# Altium project stm32f103_64_plc_PCB.PrjPcb
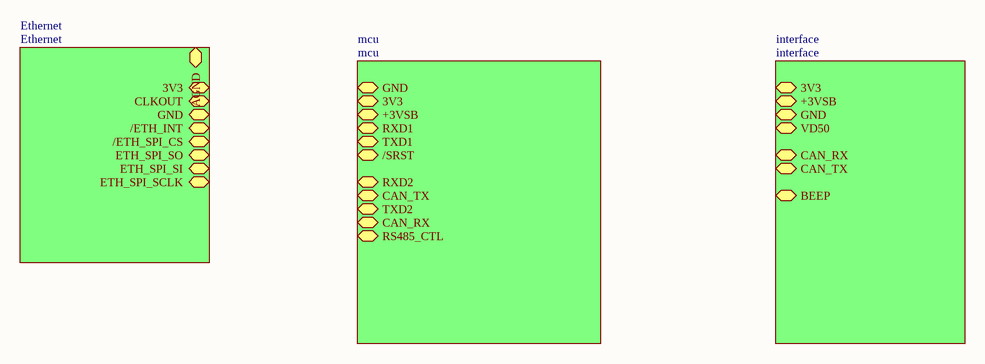
[diagram p0: root.SchDoc]
4 sheets, 109 parts. Net scope: hierarchical (ports join the sheet entries above them; power ports are global).
Board file: plc.PcbDoc
Sheets:
  root.SchDoc
    mcu = mcu.SchDoc
    interface = interface.SchDoc
    Ethernet = Ethernet.SchDoc

## Sheet root.SchDoc
size A4

### Sub-sheets
Ethernet = Ethernet: 3V3, CLKOUT, GND, /ETH_INT, /ETH_SPI_CS, ETH_SPI_SO, ETH_SPI_SI, ETH_SPI_SCLK, AGND
interface = interface: 3V3, +3VSB, GND, VD50, CAN_RX, BEEP, CAN_TX
mcu = mcu: GND, 3V3, +3VSB, RXD1, TXD1, /SRST, RXD2, CAN_TX, TXD2, CAN_RX, RS485_CTL

### Nets
3V3: sheet mcu/3V3, sheet interface/3V3
GND: sheet mcu/GND, sheet interface/GND, sheet Ethernet/GND

## Sheet mcu.SchDoc
size A4
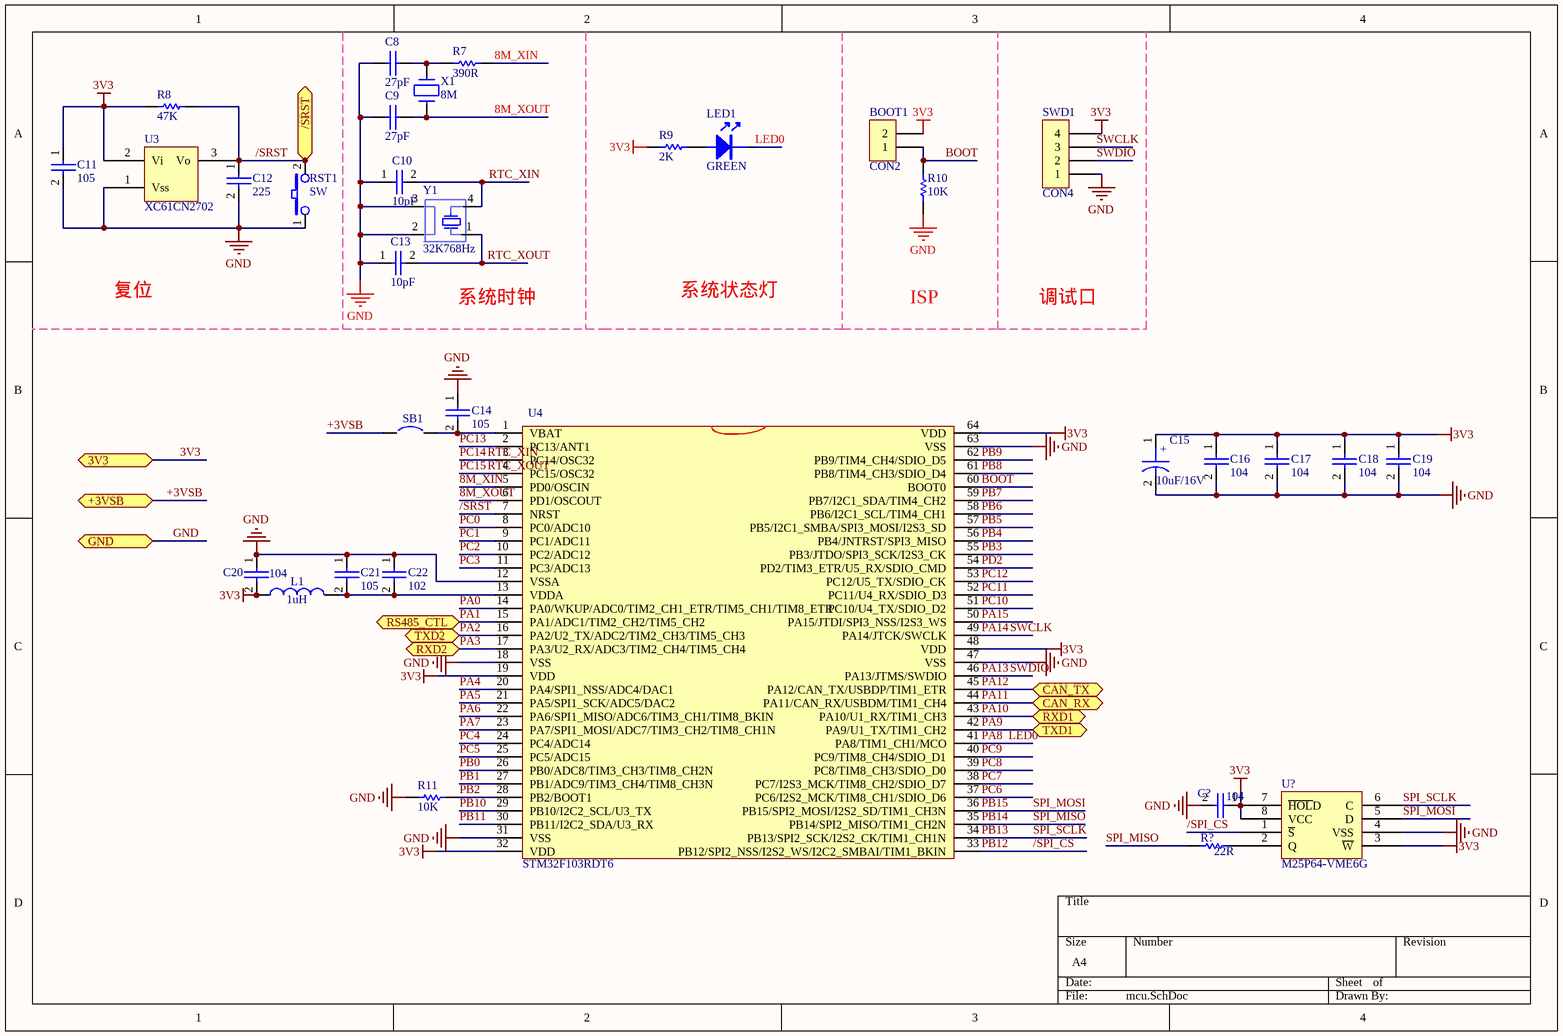
[diagram p1: mcu.SchDoc]

### Parts
(Parts that share a designator on the sheet are numbered #1, #2 ... from top to bottom, then left to right.)
BOOT1  CON2  [SIP2]
C8  27pF  [0603C]
C9  27pF  [0603C]
C10  10pF  [0603C]
C11  105  [0603C]
C12  225  [0805]
C13  10pF  [0603C]
C14  105  [0603C]
C15  10uF/16V  [TAN-B]
C16  104  [0603C]
C17  104  [0603C]
C18  104  [0603C]
C19  104  [0603C]
C20  104  [0603C]
C21  105  [0603C]
C22  102  [0603C]
C?  104  [0603C]
L1  1uH  [0603C]
LED1  GREEN  [LED-0603]
R7  390R  [0603C]
R8  47K  [0603C]
R9  2K  [0603C]
R10  10K  [0603C]
R11  10K  [0603R]
R?#1  22R  [0603C]
RST1  SW  [5032-s]
SB1  Circuit Breaker  [JP2_SMD-2]  (value not drawn)
SWD1  CON4  [SIP4]
U3  XC61CN2702  [XC61CN2702]
U4  STM32F103RDT6  [LQFP64_M]
U?  M25P64-VME6G  [VDFPN8]
X1  8M  [XTAL]
Y1  32K768Hz  [32K768Hz]

### Ports
3V3, +3VSB, /SRST, CAN_RX, CAN_TX, GND, RS485_CTL, RXD1, RXD2, TXD1, TXD2

### Nets
3V3: BOOT1.2 C11.1 C15.1 C16.1 C17.1 C18.1 C19.1 C20.2 C?.1 L1.1 R8.1 R9.2 SWD1.4 U3.2(Vi) U4.19(VDD) U4.32(VDD) U4.48(VDD) U4.64(VDD) U?.3(~{W}) U?.7(~{HOL}D) U?.8(VCC) ; port 3V3
GND: C8.1 C9.1 C10.1 C11.2 C12.2 C13.1 C14.1 C15.2 C16.2 C17.2 C18.2 C19.2 C20.1 C21.1 C22.1 C?.2 R10.1 R11.2 RST1.1 SWD1.1 U3.1(Vss) U4.12(VSSA) U4.18(VSS) U4.31(VSS) U4.47(VSS) U4.63(VSS) U?.4(VSS) Y1.2 Y1.3 ; port GND
8M_XIN: R7.1 U4.5(PD0/OSCIN)
8M_XOUT: C9.2 U4.6(PD1/OSCOUT) X1.1
+3VSB: SB1.1 ; port +3VSB
/SPI_CS: U4.33(PB12/SPI2_NSS/I2S2_WS/I2C2_SMBAI/TIM1_BKIN) U?.1(~{S})  [also labelled PB12]
/SRST: C12.1 R8.2 RST1.2 U3.3(Vo) U4.7(NRST) ; port /SRST
BOOT: BOOT1.1 R10.2 U4.60(BOOT0)
LED0: LED1.2 U4.41(PA8/TIM1_CH1/MCO)  [also labelled PA8]
PA0: U4.14(PA0/WKUP/ADC0/TIM2_CH1_ETR/TIM5_CH1/TIM8_ETR)
PA1: U4.15(PA1/ADC1/TIM2_CH2/TIM5_CH2) ; port RS485_CTL
PA2: U4.16(PA2/U2_TX/ADC2/TIM2_CH3/TIM5_CH3) ; port TXD2
PA3: U4.17(PA3/U2_RX/ADC3/TIM2_CH4/TIM5_CH4) ; port RXD2
PA4: U4.20(PA4/SPI1_NSS/ADC4/DAC1)
PA5: U4.21(PA5/SPI1_SCK/ADC5/DAC2)
PA6: U4.22(PA6/SPI1_MISO/ADC6/TIM3_CH1/TIM8_BKIN)
PA7: U4.23(PA7/SPI1_MOSI/ADC7/TIM3_CH2/TIM8_CH1N)
PA9: U4.42(PA9/U1_TX/TIM1_CH2) ; port TXD1
PA10: U4.43(PA10/U1_RX/TIM1_CH3) ; port RXD1
PA11: U4.44(PA11/CAN_RX/USBDM/TIM1_CH4) ; port CAN_RX
PA12: U4.45(PA12/CAN_TX/USBDP/TIM1_ETR) ; port CAN_TX
PA13: SWD1.2 U4.46(PA13/JTMS/SWDIO)  [also labelled SWDIO]
PA14: SWD1.3 U4.49(PA14/JTCK/SWCLK)  [also labelled SWCLK]
PA15: U4.50(PA15/JTDI/SPI3_NSS/I2S3_WS)
PB0: U4.26(PB0/ADC8/TIM3_CH3/TIM8_CH2N)
PB1: U4.27(PB1/ADC9/TIM3_CH4/TIM8_CH3N)
PB2: R11.1 U4.28(PB2/BOOT1)
PB3: U4.55(PB3/JTDO/SPI3_SCK/I2S3_CK)
PB4: U4.56(PB4/JNTRST/SPI3_MISO)
PB5: U4.57(PB5/I2C1_SMBA/SPI3_MOSI/I2S3_SD)
PB6: U4.58(PB6/I2C1_SCL/TIM4_CH1)
PB7: U4.59(PB7/I2C1_SDA/TIM4_CH2)
PB8: U4.61(PB8/TIM4_CH3/SDIO_D4)
PB9: U4.62(PB9/TIM4_CH4/SDIO_D5)
PB10: U4.29(PB10/I2C2_SCL/U3_TX)
PB11: U4.30(PB11/I2C2_SDA/U3_RX)
PB13: U4.34(PB13/SPI2_SCK/I2S2_CK/TIM1_CH1N) U?.6(C)  [also labelled SPI_SCLK]
PB14: R?#1.1 U4.35(PB14/SPI2_MISO/TIM1_CH2N)  [also labelled SPI_MISO]
PB15: U4.36(PB15/SPI2_MOSI/I2S2_SD/TIM1_CH3N) U?.5(D)  [also labelled SPI_MOSI]
PC0: U4.8(PC0/ADC10)
PC1: U4.9(PC1/ADC11)
PC2: U4.10(PC2/ADC12)
PC3: U4.11(PC3/ADC13)
PC4: U4.24(PC4/ADC14)
PC5: U4.25(PC5/ADC15)
PC6: U4.37(PC6/I2S2_MCK/TIM8_CH1/SDIO_D6)
PC7: U4.38(PC7/I2S3_MCK/TIM8_CH2/SDIO_D7)
PC8: U4.39(PC8/TIM8_CH3/SDIO_D0)
PC9: U4.40(PC9/TIM8_CH4/SDIO_D1)
PC10: U4.51(PC10/U4_TX/SDIO_D2)
PC11: U4.52(PC11/U4_RX/SDIO_D3)
PC12: U4.53(PC12/U5_TX/SDIO_CK)
PC13: U4.2(PC13/ANT1)
PC14: C10.2 U4.3(PC14/OSC32) Y1.4  [also labelled RTC_XIN]
PC15: C13.2 U4.4(PC15/OSC32) Y1.1  [also labelled RTC_XOUT]
PD2: U4.54(PD2/TIM3_ETR/U5_RX/SDIO_CMD)
NetC8_2: C8.2 R7.2 X1.2
NetC14_2: C14.2 SB1.2 U4.1(VBAT)
NetC21_2: C21.2 C22.2 L1.2 U4.13(VDDA)
NetLED1_1: LED1.1 R9.1
NetR?#1_2: R?#1.2 U?.2(Q)

### Notes on the sheet
- 复位
- 系统时钟
- 系统状态灯
- ISP
- 调试口
- (in symbol CAPACITOR POL_0) +

### Library data of the parts
BOOT1 = CON2: Connector
C8-C14 C16-C22 C? = CAP: Capacitor
C15 = CAPACITOR POL_0: Text Field1: 20; Text Field2: 20
L1 = Inductor: Value: 100uH; Published: 8-Jun-2000; Revision: July-2002: Re-released for DXP Platform.; Publisher: Altium Limited
LED1 = LED
R7 R10 R?#1 = Res1: Resistor; Value: 1K; Published: 8-Jun-2000; Revision: July-2002: Re-released for DXP Platform.; Publisher: Altium Limited
R8 R9 R11 = res1: Resistor; Value: 1K; Published: 8-Jun-2000; Revision: July-2002: Re-released for DXP Platform.; Publisher: Altium Limited
RST1 = SW_PUSH: Text Field1: 30; Text Field2: 30
SB1 = Circuit Breaker: Solder: NO; Published: 24-Mar-1999; Revision: July-2002: Re-released for DXP Platform.; Publisher: Altium Limited
SWD1 = CON4: Connector
X1 = CRYSTAL: Part Field 1: 1; Part Field 5: 1; Part Field 6: 1000K

## Sheet interface.SchDoc
size A4
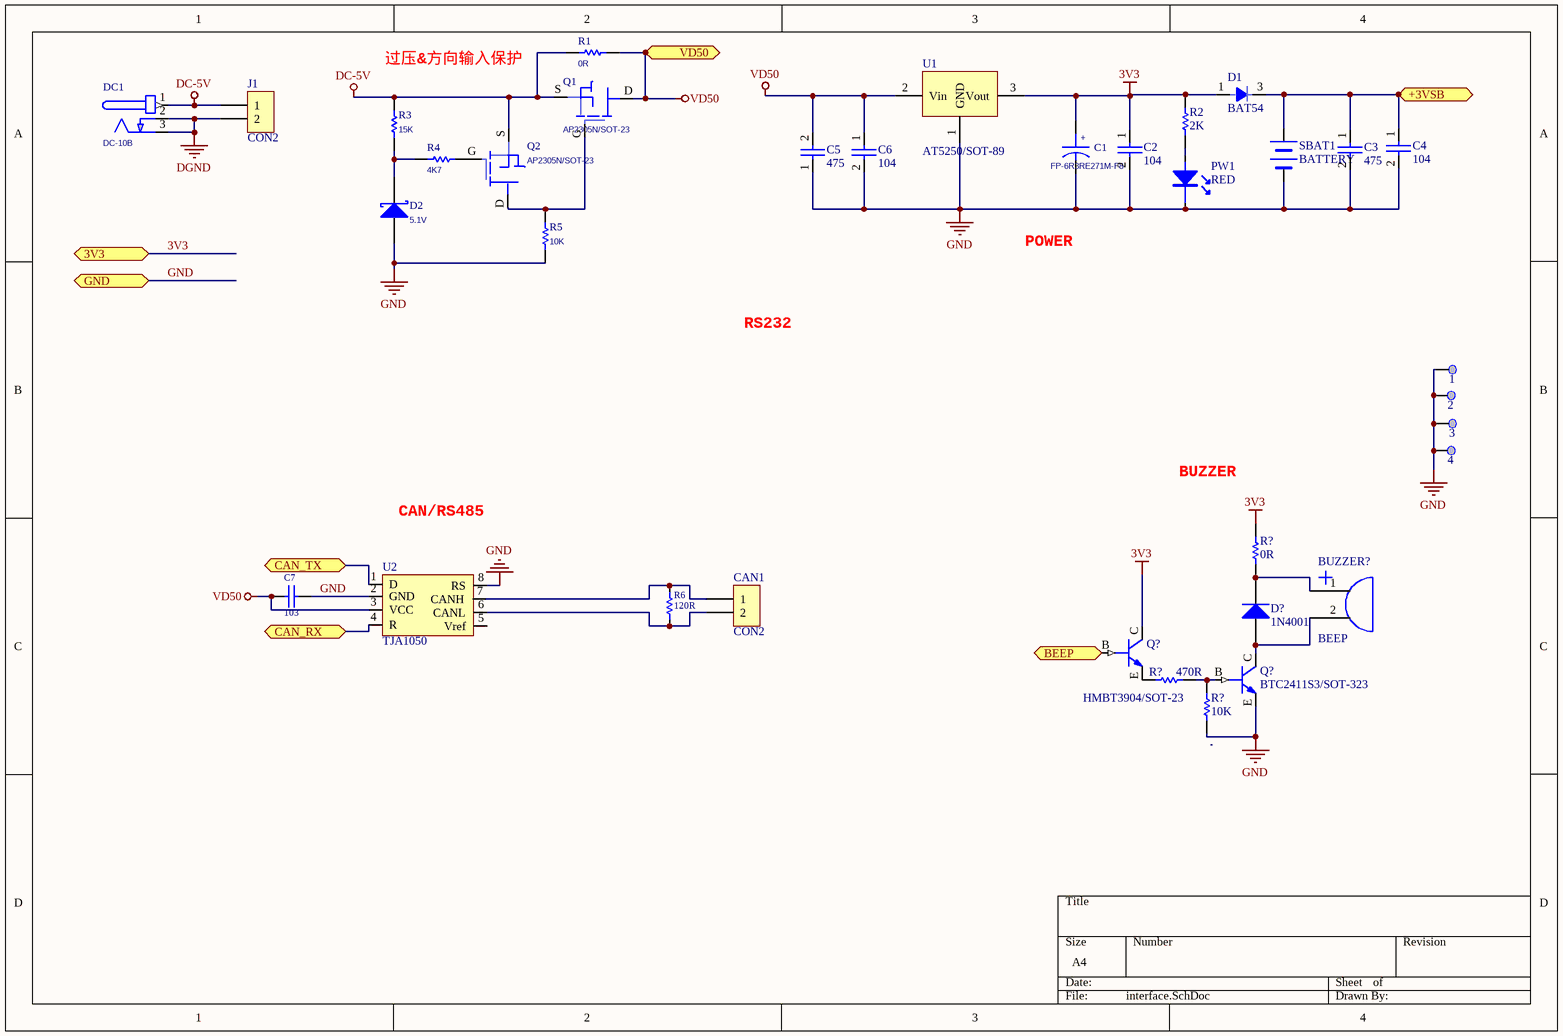
[diagram p2: interface.SchDoc]

### Parts
(Parts that share a designator on the sheet are numbered #1, #2 ... from top to bottom, then left to right.)
1  TP  [HOLE53]  (value not drawn)
2  TP  [HOLE53]  (value not drawn)
3  TP  [HOLE53]  (value not drawn)
4  TP  [HOLE53]  (value not drawn)
BUZZER?  BEEP  [BUZZER]
C1  FP-6R3RE271M-F8  [6R3RE271M]
C2  104  [0603C]
C3  475  [0805]
C4  104  [0603C]
C5  475  [0805]
C6  104  [0603C]
C7  103  [0603C]
CAN1  CON2  [INTERFACE-2]
D1  BAT54  [BAT54]
D2  5.1V  [SOD-123_1N5819HW]
D?  Type: 1N4001  [1N5819S]  (hidden comment: Diode)
DC1  DC-10B  [DC-JACK]
J1  CON2  [INTERFACE-2]
PW1  RED  [LED-0603]
Q1  AP2305N/SOT-23  [AP2305N_SOT23]
Q2  AP2305N/SOT-23  [AP2305N_SOT23]
Q?#1  HMBT3904/SOT-23  [SOT-23_HMBT3904]
Q?#2  BTC2411S3/SOT-323  [SOT-23_HMBT3904]
R1  0R  [0603C]
R2  2K  [0603C]
R3  15K  [0603C]
R4  4K7  [0603C]
R5  10K  [0603C]
R6  120R  [0805]
R?#2  0R  [0603C]
R?#3  470R  [0603C]
R?#4  10K  [0603C]
SBAT1  BATTERY  [LI1220_1]
U1  AT5250/SOT-89  [AT5250]
U2  TJA1050  [SOP-8]

### Ports
3V3, +3VSB, BEEP, CAN_RX, CAN_TX, GND, VD50

### Nets
3V3: C1.1 C2.1 D1.1 Q?#1.C(COLLECTOR) R2.1 R?#2.2 U1.3(Vout) ; port 3V3
DC-5V: DC1.1(+) J1.2(1) Q1.S Q2.S R1.2 R3.2
DGND: DC1.2(GND) DC1.3(GND) J1.1(2)
GND: 1.1 2.1 3.1 4.1 C1.2 C2.2 C3.2 C4.2 C5.1 C6.2 C7.2 D2.2(A) PW1.2 Q?#2.E(EMITTER) R5.1 R?#4.1 SBAT1.2 U1.1(GND) U2.2(GND) U2.8(RS) ; port GND
VD50: C5.2 C6.1 C7.1 Q1.D R1.1 U1.2(Vin) U2.3(VCC) ; port VD50
NetBUZZER?_1: BUZZER?.1 D?.2(K) R?#2.1
NetBUZZER?_2: BUZZER?.2 D?.1(A) Q?#2.C(COLLECTOR)
NetC3_1: C3.1 C4.1 D1.3 SBAT1.1 ; port +3VSB
NetCAN1_1: CAN1.1(2) R6.2 U2.6(CANL)
NetCAN1_2: CAN1.2(1) R6.1 U2.7(CANH)
NetD2_1: D2.1(K) R3.1 R4.2
NetPW1_1: PW1.1 R2.2
NetQ1_G: Q1.G Q2.D R5.2
NetQ2_G: Q2.G R4.1
NetQ?#1_B: Q?#1.B(BASE) ; port BEEP
NetQ?#1_E: Q?#1.E(EMITTER) R?#3.1
NetQ?#2_B: Q?#2.B(BASE) R?#3.2 R?#4.2
NetU2_1: U2.1(D) ; port CAN_TX
NetU2_4: U2.4(R) ; port CAN_RX

Not connected (* = marked no-connect by the designer): U2 5(Vref)

### Notes on the sheet
- (near R3) 过压&方向输入保护
- POWER
- RS232
- CAN/RS485
- BUZZER
- (in symbol CAP POL) +

### Library data of the parts
BUZZER? = BEEP: 蜂鸣器
C1 = CAP POL
C2-C6 = CAP: Capacitor
C7 = Cap: Capacitor; Published: *; Publisher: *; Manufacturer: *; Class: *; SubClass: *; C13: *
CAN1 J1 = CON2: Connector
D2 = Diode 10TQ035: Schottky Rectifier; Note: Terminal 2 is the TAB and is electrically connected to the cathode; Published: 8-Jun-2000; LatestRevisionDate: 17-Jul-2002; LatestRevisionNote: Re-released for DXP Platform.; DatasheetVersion: PD-2.057B; PackageVersion: Feb-1998; PackageReference: TO-220AC; Publisher: Altium Limited; PackageDescription: TO, Thru-Hole, Vertical, Heatsink Mounted; 3 In-Line Leads (1 Absent); Pitch 2.54 mm; ComponentLink1Description: Manufacturer Link; ComponentLink1URL: http://www.irf.com/; ComponentLink2Description: Datasheet; ComponentLink2URL: http://www.irf.com/product-info/datasheets/data/10tq.pdf
D? = Diode: 二极管; Published: 8-Jun-2000; LatestRevisionDate: 17-Jul-2002; LatestRevisionNote: Re-released for DXP Platform.; PackageDocument: Sep-1996; PackageReference: SMC; Publisher: Altium Limited; Code_JEDEC: DO-214-AB
DC1 = PJ202A
PW1 = LED
Q?#2 = HMBT3904/SOT-23
R1-R5 R?#2-R?#4 = res1: Resistor; Value: 1K; Published: 8-Jun-2000; Revision: July-2002: Re-released for DXP Platform.; Publisher: Altium Limited
R6 = Res1: Resistor; Published: *; Revision: *; Publisher: *; Value: *
U1 = XC62FP3302PR

## Sheet Ethernet.SchDoc
size A3
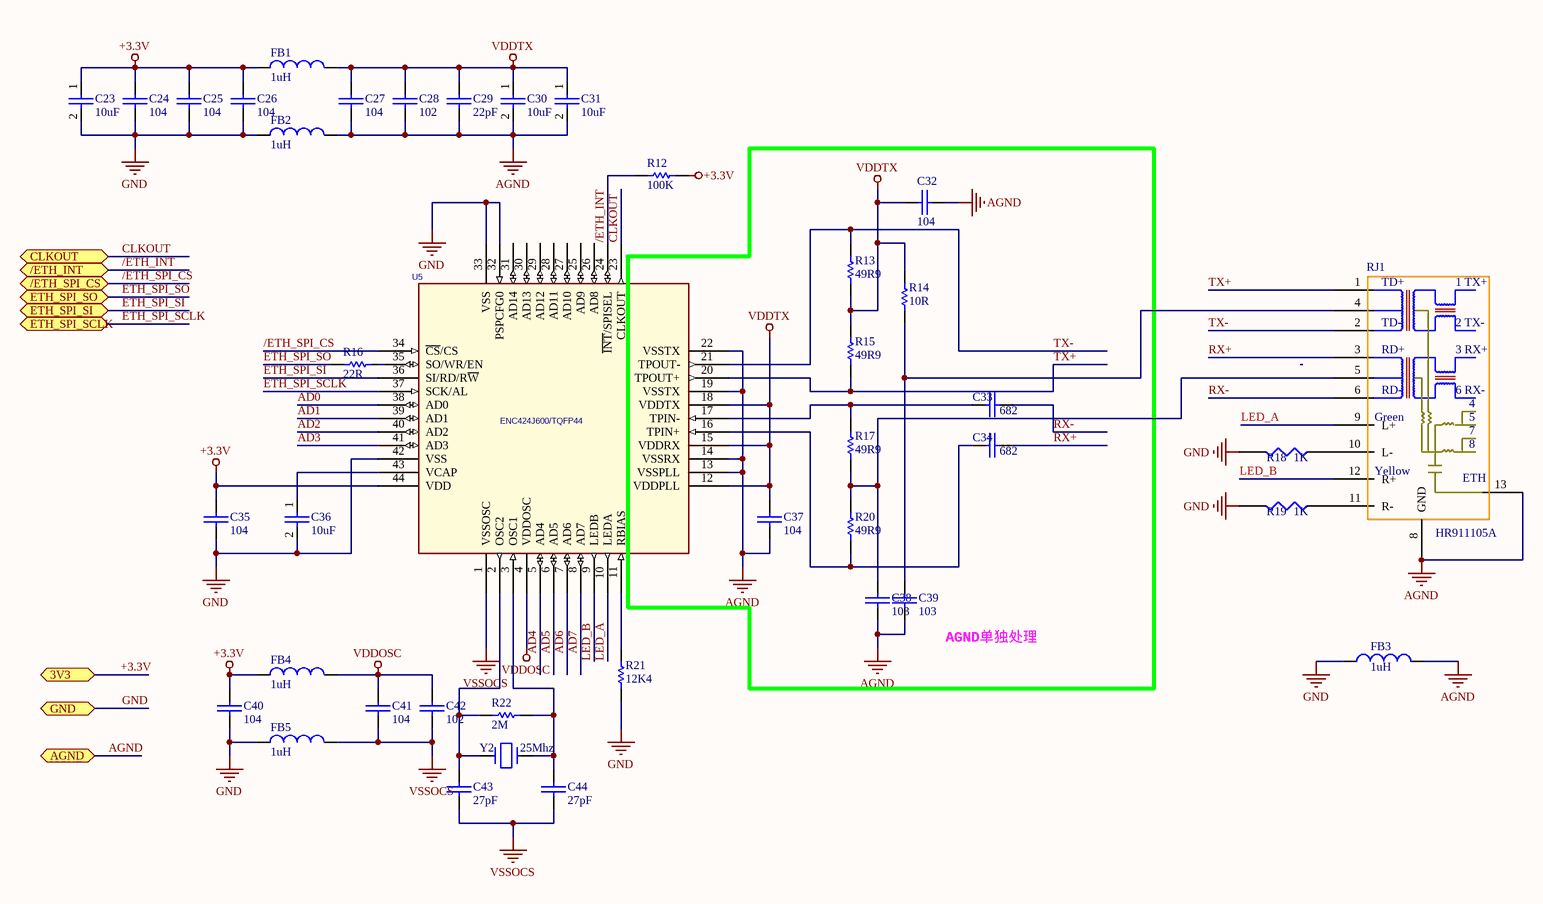
[diagram p3: Ethernet.SchDoc]

### Parts
C23  10uF  [0805]
C24  104  [0603C]
C25  104  [0603C]
C26  104  [0603C]
C27  104  [0603C]
C28  102  [0603C]
C29  22pF  [0603C]
C30  10uF  [0805]
C31  10uF  [0805]
C32  104  [0603C]
C33  682  [0603C]
C34  682  [0603C]
C35  104  [0603C]
C36  10uF  [0805]
C37  104  [0603C]
C38  103  [0603C]
C39  103  [0603C]
C40  104  [0603C]
C41  104  [0603C]
C42  102  [0603C]
C43  27pF  [0603C]
C44  27pF  [0603C]
FB1  1uH  [0603R]
FB2  1uH  [0603R]
FB3  1uH  [0805]
FB4  1uH  [0603R]
FB5  1uH  [0603R]
R12  100K  [0603R]
R13  49R9  [0603R]
R14  10R  [0603R]
R15  49R9  [0603R]
R16  22R  [0603R]
R17  49R9  [0603R]
R18  1K  [0603C]
R19  1K  [0603C]
R20  49R9  [0603R]
R21  12K4  [0603R]
R22  2M  [0603R]
RJ1  HR911105A  [HR911105A]
U5  ENC424J600/TQFP44  [TQFP44]
Y2  25Mhz  [XTAL]

### Blocks framed on the sheet
AGND单独处理: C32-C34 C37-C39 R13-R15 R17 R20

### Ports
3V3, /ETH_INT, /ETH_SPI_CS, AGND, CLKOUT, ETH_SPI_SCLK, ETH_SPI_SI, ETH_SPI_SO, GND

### Nets
+3.3V: C23.1 C24.2 C25.2 C26.2 C35.2 C40.2 FB1.1 FB4.1 R12.2 U5.44(VDD) ; port 3V3
AGND: C27.1 C28.1 C29.1 C30.2 C31.2 C32.1 C37.1 C38.1 C39.1 FB2.2 FB3.2 RJ1.8(GND) RJ1.13 U5.13(VSSPLL) U5.14(VSSRX) U5.19(VSSTX) U5.22(VSSTX) ; port AGND
GND: C23.2 C24.1 C25.1 C26.1 C35.1 C36.2 C40.1 FB2.1 FB3.1 FB5.1 R18.2 R19.2 R21.2 U5.32(PSPCFG0) U5.33(VSS) U5.42(VSS) ; port GND
VDDOSC: C41.2 C42.2 FB4.2 U5.4(VDDOSC)
VDDTX: C27.2 C28.2 C29.2 C30.1 C31.1 C32.2 C37.2 FB1.2 R13.1 R14.2 R15.2 U5.12(VDDPLL) U5.15(VDDRX) U5.18(VDDTX)
VSSOCS: C41.1 C42.1 C43.1 C44.1 FB5.2 U5.1(VSSOSC)
/ETH_INT: R12.1 U5.24(~{INT}/SPISEL) ; port /ETH_INT
/ETH_SPI_CS: U5.34(~{CS}/CS) ; port /ETH_SPI_CS
AD0: U5.38(AD0)
AD1: U5.39(AD1)
AD2: U5.40(AD2)
AD3: U5.41(AD3)
AD4: U5.5(AD4)
AD5: U5.6(AD5)
AD6: U5.7(AD6)
AD7: U5.8(AD7)
CLKOUT: U5.23(CLKOUT) ; port CLKOUT
ETH_SPI_SCLK: U5.37(SCK/AL) ; port ETH_SPI_SCLK
ETH_SPI_SI: U5.36(SI/RD/R~{W}) ; port ETH_SPI_SI
ETH_SPI_SO: R16.1 ; port ETH_SPI_SO
LED_A: RJ1.9(L+) U5.10(LEDA)
LED_B: RJ1.12(R+) U5.9(LEDB)
RX+: C34.1 RJ1.3
RX-: C33.1 RJ1.6
TX+: R15.1 RJ1.1 U5.20(TPOUT+)
TX-: R13.2 RJ1.2 U5.21(TPOUT-)
NetC33_2: C33.2 R17.2 U5.17(TPIN-)
NetC34_2: C34.2 R20.1 U5.16(TPIN+)
NetC36_1: C36.1 U5.43(VCAP)
NetC38_2: C38.2 R17.1 R20.2 RJ1.5
NetC39_2: C39.2 R14.1 RJ1.4
NetC43_2: C43.2 R22.2 U5.2(OSC2) Y2.2
NetC44_2: C44.2 R22.1 U5.3(OSC1) Y2.1
NetR16_2: R16.2 U5.35(SO/WR/EN)
NetR18_1: R18.1 RJ1.10(L-)
NetR19_1: R19.1 RJ1.11(R-)
NetR21_1: R21.1 U5.11(RBIAS)

Not connected (* = marked no-connect by the designer): U5 25(AD9) 26(AD8) 27(AD10) 28(AD11) 29(AD12) 30(AD13) 31(AD14)

### Notes on the sheet
- (in symbol HR911105A) TD+; 1 TX+; TD-; 2 TX-; RD+; 3 RX+; RD-; 6 RX-; Green; 7; Yellow; ETH

### Library data of the parts
C23-C44 = CAP: Capacitor
FB1-FB5 = Inductor: Value: 100uH; Published: 8-Jun-2000; Revision: July-2002: Re-released for DXP Platform.; Publisher: Altium Limited
R12-R17 R20-R22 = res1: Resistor; Value: 1K; Published: 8-Jun-2000; Revision: July-2002: Re-released for DXP Platform.; Publisher: Altium Limited
R18 R19 = RES1
Y2 = CRYSTAL: Part Field 1: 1; Part Field 5: 1; Part Field 6: 1000K

## Nets that join several sheets
3V3: mcu (21 pins), interface (7 pins)
GND: mcu (29 pins), interface (20 pins), Ethernet (16 pins)